# Altium schematic sheet Top.SchDoc
size B; DocumentNumber: 7; Revision: 1.0; SheetNumber: 1; SheetTotal: 7
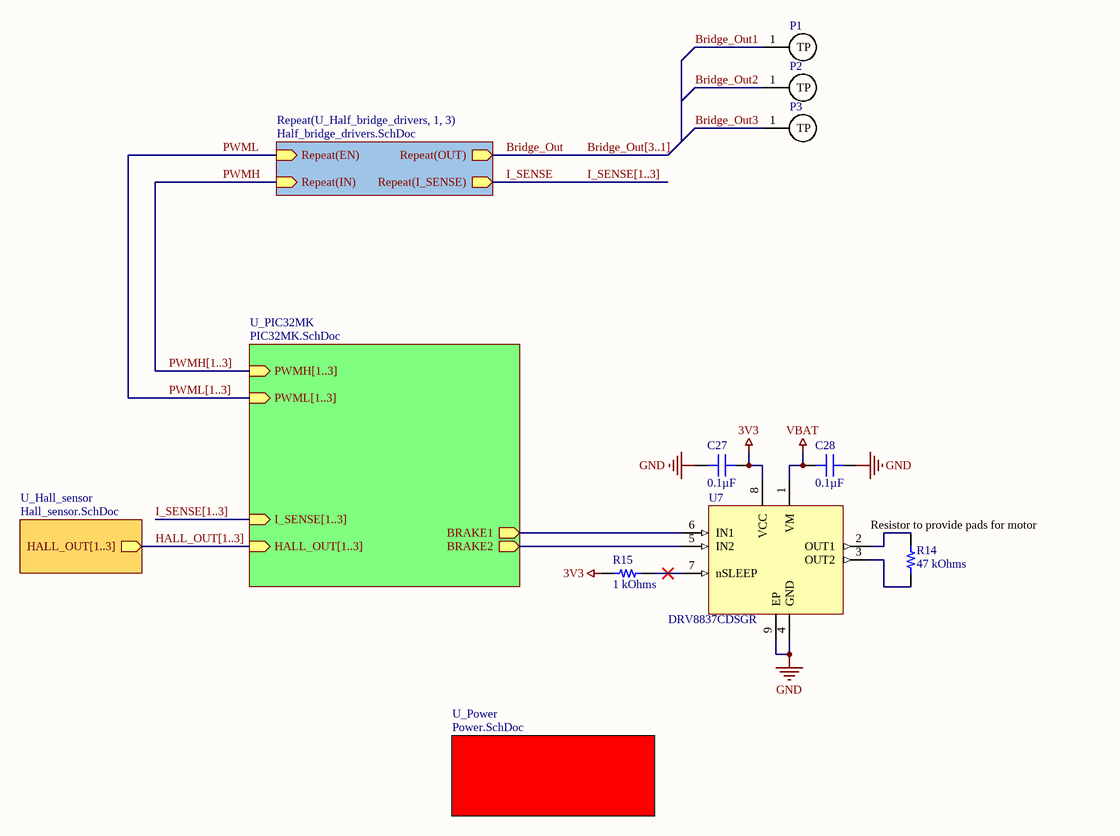
[diagram p0: Top.SchDoc]

## Parts
C27  0.1µF  [CAP 0603_1608]
C28  0.1µF  [CAP 0603_1608]
P1  TP  [2mmHole]  (value not drawn)
P2  TP  [2mmHole]  (value not drawn)
P3  TP  [2mmHole]  (value not drawn)
R14  47 kOhms  [RES 2512_6432]
R15  1 kOhms  [RES 0603_1608]
U7  DRV8837CDSGR  [SON50P200X200X80-9N]

## Sub-sheets
Repeat(U_Half_bridge_drivers, 1, 3) = Half_bridge_drivers.SchDoc: Repeat(EN) (in), Repeat(IN) (in), Repeat(OUT) (out), Repeat(I_SENSE) (out)
U_Hall_sensor = Hall_sensor.SchDoc: HALL_OUT[1..3] (out)
U_PIC32MK = PIC32MK.SchDoc: I_SENSE[1..3] (in), HALL_OUT[1..3] (in), PWMH[1..3] (in), PWML[1..3] (in), BRAKE2 (out), BRAKE1 (out)
U_Power = Power.SchDoc: no entries

## Nets
3V3: C27.2 R15.2 U7.8(VCC)
GND: C27.1 C28.2 U7.4(GND) U7.9(EP)
VBAT: C28.1 U7.1(VM)
Bridge_Out: sheet Repeat(U_Half_bridge_drivers, 1, 3)/Repeat(OUT)
Bridge_Out1: P1.1(TP)
Bridge_Out2: P2.1(TP)
Bridge_Out3: P3.1(TP)
I_SENSE: sheet Repeat(U_Half_bridge_drivers, 1, 3)/Repeat(I_SENSE)
PWMH: sheet Repeat(U_Half_bridge_drivers, 1, 3)/Repeat(IN)
PWML: sheet Repeat(U_Half_bridge_drivers, 1, 3)/Repeat(EN)
NetR14_1: R14.1 U7.2(OUT1)
NetR14_2: R14.2 U7.3(OUT2)
NetR15_1: R15.1 U7.7(nSLEEP)
NetU7_5: U7.5(IN2) ; sheet U_PIC32MK/BRAKE2
NetU7_6: U7.6(IN1) ; sheet U_PIC32MK/BRAKE1

## Buses and harness runs
bus Bridge_Out[3..1]
bus HALL_OUT[1..3] = sheet U_Hall_sensor/HALL_OUT[1..3] = sheet U_PIC32MK/HALL_OUT[1..3]
bus I_SENSE[1..3]
bus I_SENSE[1..3] = sheet U_PIC32MK/I_SENSE[1..3]
bus PWMH[1..3] = sheet U_PIC32MK/PWMH[1..3]
bus PWML[1..3] = sheet U_PIC32MK/PWML[1..3]

## Notes on the sheet
- (near R14) Resistor to provide pads for motor

## Library data of the parts
C27 C28 = GCG188R92A104KA03D: CAP CER 0.1UF 100V 0603 EPOXY; Manufacturer: Murata Electronics; Temperature Coefficient: X8R; Tolerance: ±10%; Part Number: GCG188R92A104KA03D; Value: 0.1µF; Applications: Automotive; Capacitance: 0.1µF; ComponentLink1Description: Datasheet; ComponentLink1URL: https://search.murata.co.jp/Ceramy/image/img/A01X/G101/ENG/GCG188R92A104KA03-01.pdf; ComponentLink2Description: DigiKey Link; ComponentLink2URL: http://digikey.com/product-detail/en/murata-electronics/GCG188R92A104KA03D/490-18197-1-ND/9867926; Device Package: 0603 (1608 Metric); Features: Epoxy Mountable; LastUpdated: 21-Jan-20 12:01:59 AM; Lifecycle Status: Active; Minimum Order: 1; Mounting Type: Surface Mount, MLCC, Epoxy; Operating Temperature: -55°C ~ 150°C; Package / Case: 0603 (1608 Metric); Packaging: TapeAndReel; PartId: 9025; Part Status: Active; Price: 0.07; Ratings: AEC-Q200; Series: GCG; Size / Dimension: 0.063" L x 0.031" W (1.60mm x 0.80mm); Supplier 1: DigiKey; Supplier Part Number 1: 490-18197-1-ND; Thickness (Max): 0.035" (0.90mm); Voltage - Rated: 100V
R14 = RK73B3ATTE473J: RES 47K OHM 5% 1W 2512; Manufacturer: KOA Speer Electronics, Inc.; Temperature Coefficient: ±200ppm/°C; Part Number: RK73B3ATTE473J; ComponentLink1Description: Datasheet; ComponentLink1URL: http://www.koaspeer.com/catimages/Products/RK73B/RK73B.pdf; ComponentLink2Description: DigiKey Link; ComponentLink2URL: http://digikey.com/product-detail/en/koa-speer-electronics-inc/RK73B3ATTE473J/2019-RK73B3ATTE473JCT-ND/10425370; Composition: Thick Film; Device Package: 2512 (6432 Metric); Features: Automotive AEC-Q200, Moisture Resistant; Height - Seated (Max): 0.028" (0.70mm); LastUpdated: 21-Jan-20 4:26:21 AM; Lifecycle Status: Active; Minimum Order: 1; Number of Terminations: 2; Operating Temperature: -55°C ~ 155°C; Package / Case: 2512 (6432 Metric); Packaging: TapeAndReel; Part Status: Active; Power (Watts): 1W; Price: 0.04; Ratings: AEC-Q200; Resistance: 47 kOhms; Series: RK73B; Size / Dimension: 0.248" L x 0.122" W (6.30mm x 3.10mm); Supplier 1: DigiKey; Supplier Part Number 1: 2019-RK73B3ATTE473JCT-ND; Supplier Device Package: 2512; Tolerance: ±5%; Value: 47 kOhms
R15 = RT0603FRE071KL: RES SMD 1K OHM 1% 1/10W 0603; Manufacturer: Yageo; Power (Watts): 0.1W, 1/10W; Temperature Coefficient: ±50ppm/°C; Part Number: RT0603FRE071KL; Value: 1 kOhms; ComponentLink1Description: Datasheet; ComponentLink1URL: https://www.yageo.com/upload/media/product/productsearch/datasheet/rchip/PYu-RT_1-to-0.01_RoHS_L_11.pdf; ComponentLink2Description: DigiKey Link; ComponentLink2URL: http://digikey.com/product-detail/en/yageo/RT0603FRE071KL/YAG2323CT-ND/5252437; Composition: Thin Film; Device Package: 0603 (1608 Metric); Height - Seated (Max): 0.022" (0.55mm); LastUpdated: 21-Jan-20 12:24:38 AM; Lifecycle Status: Active; Minimum Order: 1; Number of Terminations: 2; Operating Temperature: -55°C ~ 155°C; Package / Case: 0603 (1608 Metric); Packaging: TapeAndReel; PartId: 5672; Part Status: Active; Price: 0.01; Resistance: 1 kOhms; Series: RT; Size / Dimension: 0.063" L x 0.031" W (1.60mm x 0.80mm); Supplier 1: DigiKey; Supplier Part Number 1: YAG2323CT-ND; Supplier Device Package: 0603; Tolerance: ±1%
U7 = DRV8837CDSGR: 11-V, 1-A H-bridge motor driver 8-WSON -40 to 85; MF: Texas Instruments; Mouser-Purchase-URL: https://snapeda.com/shop?store=Mouser&id=617854; Value: *; DigiKey-Purchase-URL: https://snapeda.com/shop?store=DigiKey&id=617854; Package: WSON-8 Texas Instruments; Texas_Instruments-Purchase-URL: https://snapeda.com/shop?store=Texas+Instruments&id=617854; Price: None; MP: DRV8837CDSGR; SnapEDA_Link: https://www.snapeda.com/parts/DRV8837CDSGR/Texas%20Instruments/view-part/617854/?ref=snap; Availability: Good